# Altium schematic sheet 接口板2.SchDoc
size A4
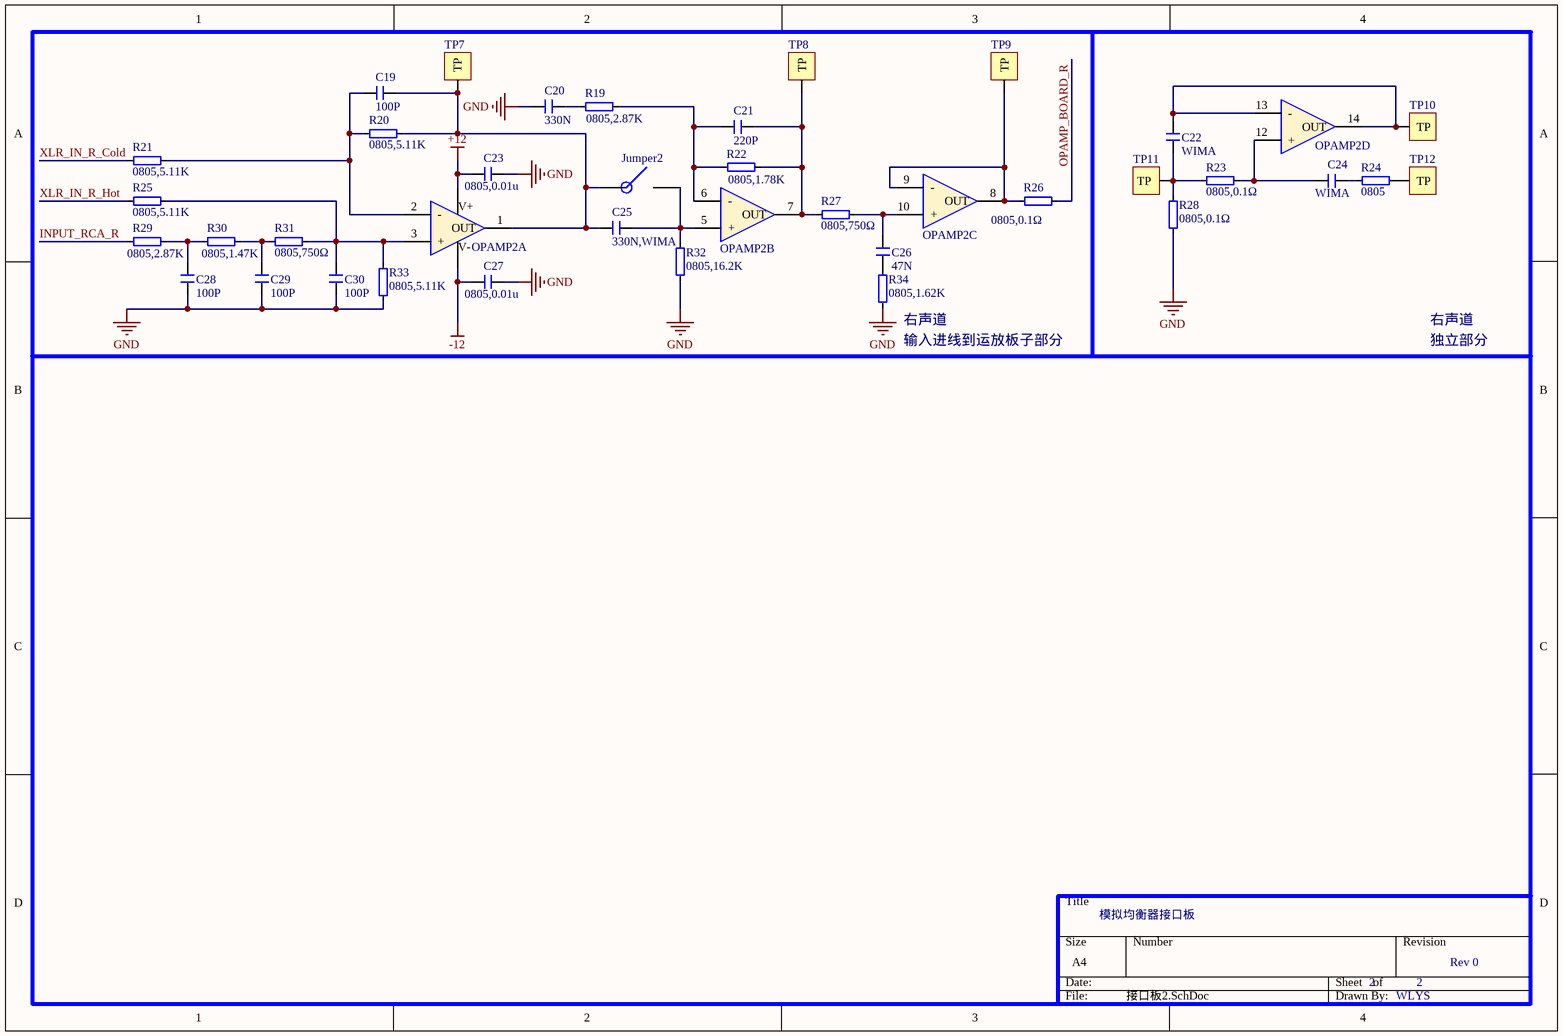
[diagram p0: 接口板2.SchDoc]

## Parts
C19  100P  [WIMA_5mm]
C20  330N  [WIMA_5mmPin*10mmL]
C21  220P  [WIMA_5mm]
C22  WIMA  [WIMA_5mm]
C23  0805,0.01u  [0805_C]
C24  WIMA  [WIMA_5mm]
C25  330N,WIMA  [WIMA_5mmPin*10mmL]
C26  47N  [WIMA_5mm]
C27  0805,0.01u  [0805_C]
C28  100P  [WIMA_5mm]
C29  100P  [WIMA_5mm]
C30  100P  [WIMA_5mm]
Jumper2  Jumper  [0805_J]  (value not drawn)
OPAMP2  4277UA  [SOIC-14_150mil]  (value not drawn)  (parts A,B,C,D of 4)
R19  0805,2.87K  [0805_R]
R20  0805,5.11K  [0805_R]
R21  0805,5.11K  [0805_R]
R22  0805,1.78K  [0805_R]
R23  0805,0.1Ω  [0805_R]
R24  0805  [0805_R]
R25  0805,5.11K  [0805_R]
R26  0805,0.1Ω  [0805_R]
R27  0805,750Ω  [0805_R]
R28  0805,0.1Ω  [0805_R]
R29  0805,2.87K  [0805_R]
R30  0805,1.47K  [0805_R]
R31  0805,750Ω  [0805_R]
R32  0805,16.2K  [0805_R]
R33  0805,5.11K  [0805_R]
R34  0805,1.62K  [0805_R]
TP7  测试点  [TestPoint]  (value not drawn)
TP8  测试点  [TestPoint]  (value not drawn)
TP9  测试点  [TestPoint]  (value not drawn)
TP10  测试点  [TestPoint]  (value not drawn)
TP11  测试点  [TestPoint]  (value not drawn)
TP12  测试点  [TestPoint]  (value not drawn)

## Nets
+12: C23.1 OPAMP2.4(V+)
-12: C27.1 OPAMP2.11(V-)
GND: C20.1 C23.2 C27.2 C28.2 C29.2 C30.2 R28.2 R32.1 R33.1 R34.1
INPUT_RCA_R: R29.1
OPAMP_BOARD_R: R26.2
XLR_IN_R_Cold: R21.2
XLR_IN_R_Hot: R25.2
NetC19_1: C19.1 OPAMP2.2(-) R20.1 R21.1
NetC19_2: C19.2 C25.1 Jumper2.1 OPAMP2.1(OUT) R20.2 TP7.1(TP)
NetC20_2: C20.2 R19.1
NetC21_1: C21.1 OPAMP2.6(-) R19.2 R22.1
NetC21_2: C21.2 OPAMP2.7(OUT) R22.2 R27.1 TP8.1(TP)
NetC22_1: C22.1 OPAMP2.13(-) OPAMP2.14(OUT) TP10.1(TP)
NetC22_2: C22.2 R23.2 R28.1 TP11.1(TP)
NetC24_1: C24.1 OPAMP2.12(+) R23.1
NetC24_2: C24.2 R24.2
NetC25_2: C25.2 Jumper2.2 OPAMP2.5(+) R32.2
NetC26_1: C26.1 OPAMP2.10(+) R27.2
NetC26_2: C26.2 R34.2
NetC28_1: C28.1 R29.2 R30.1
NetC29_1: C29.1 R30.2 R31.1
NetC30_1: C30.1 OPAMP2.3(+) R25.1 R31.2 R33.2
NetOPAMP2_8: OPAMP2.8(OUT) OPAMP2.9(-) R26.1 TP9.1(TP)
NetR24_1: R24.1 TP12.1(TP)

## Notes on the sheet
- (near R34) 输入进线到运放板子部分
- (near R34) 右声道
- 独立部分
- 右声道
- 模拟均衡器接口板
- 2
- Rev 0
- WLYS

## Library data of the parts
C19 C22 C24 C28-C30 = WIMA_CAP_100P
C20 C25 = WIMA_CAP_330N
C21 = WIMA_CAP_220P
C23 C27 = C0805
C26 = WIMA_CAP_47N
OPAMP2 = OPA4277UA
R19-R34 = R0805